# EAGLE design utilidong-ftdi-uart-mk-2.1 (EAGLE 7.5.0)
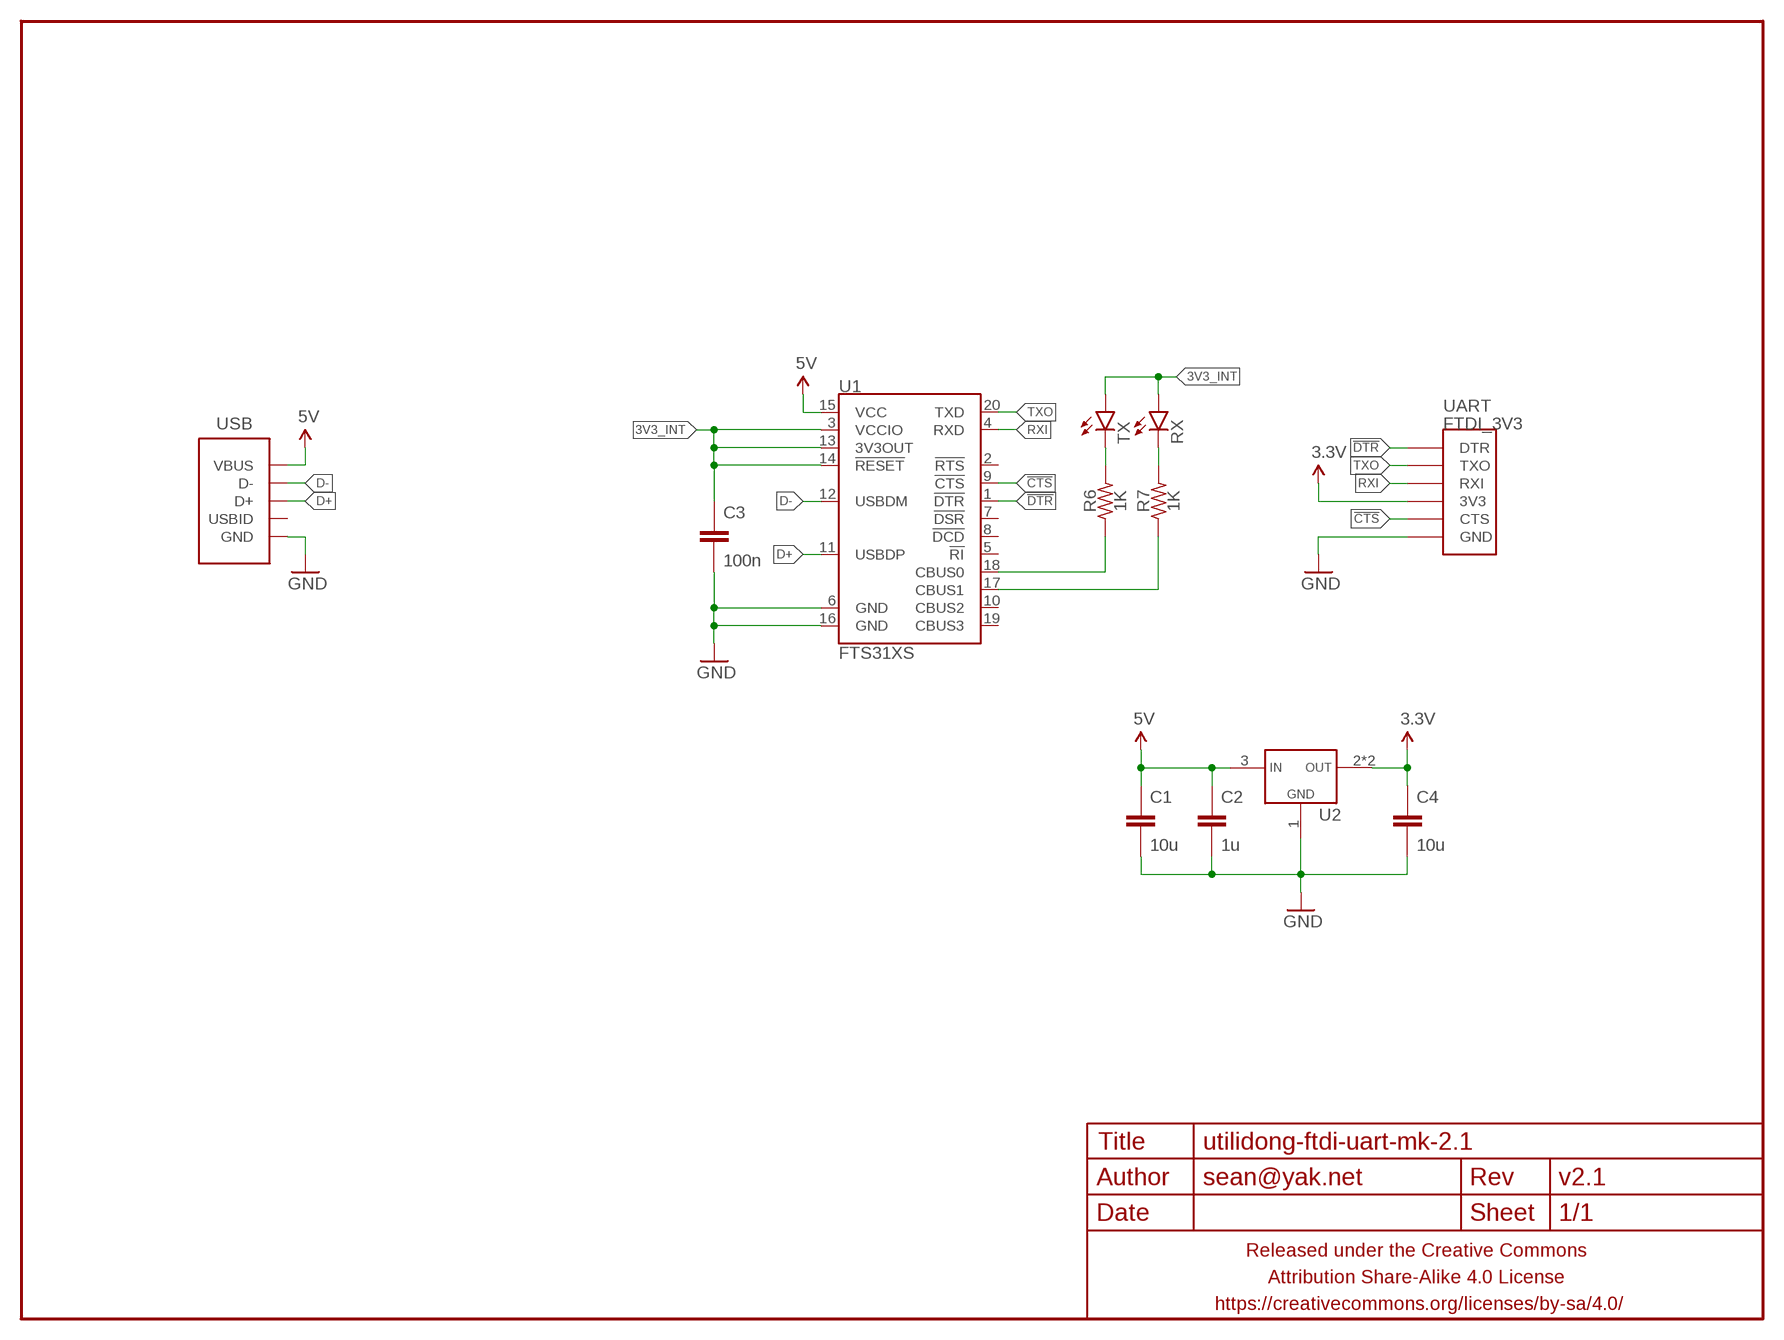
[diagram p0: schematic, sheet 1]

## Parts
C1  10u  CAPACITOR-CERAMICC0805  [C0805]
C2  1u  CAPACITOR-CERAMICC0603  [C0603]
C3  100n  CAPACITOR-CERAMICC0603  [C0603]
C4  10u  CAPACITOR-CERAMICC0805  [C0805]
FRAME1  FRAME-LETTERNO_PACKAGE  [DUMMY]
R6  1K  RESISTORR0603  [R0603]
R7  1K  RESISTORR0603  [R0603]
RX  LED0603  [LED-0603]
TX  LED0603  [LED-0603]
U1  FTS31XS  FT231XS  [SSOP20_L]
U2  VREG_1117SOT89  [SOT89]
UART  FTDI_3V3  [FTDI_3V3]
USB  USB-ABFCI-10103594-USB-MICRO-B-LESS  [FCI-10103594-USB-MICRO-B-LESS]

## Nets
3.3V: C4.1 U2.2(VOUT) U2.4(VOUT) UART.P$4(3V3)
3V3_INT: C3.1 RX.A TX.A U1.3(VCCIO) U1.13(3V3OUT) U1.14(!RESET)
5V: C1.1 C2.1 U1.15(VCC) U2.3(VIN) USB.1(VBUS)
!CTS: U1.9(!CTS) UART.P$5(CTS)
!DTR: U1.1(!DTR) UART.P$1(DTR)
D+: U1.11(USBDP) USB.3(D+)
D-: U1.12(USBDM) USB.2(D-)
GND: C1.2 C2.2 C3.2 C4.2 U1.6(GND) U1.16(GND) U2.1(GND) UART.P$6(GND) USB.5(GND)
N$7: R6.1 U1.18(CBUS0)
N$9: R6.2 TX.C
N$10: R7.2 RX.C
N$12: R7.1 U1.17(CBUS1)
RXI: U1.4(RXD) UART.P$3(RXI)
TXO: U1.20(TXD) UART.P$2(TXO)
Unconnected: U1.2(!RTS) U1.5(!RI) U1.7(!DSR) U1.8(!DCD) U1.10(CBUS2) U1.19(CBUS3) USB.4(USBID)

## Library data of the parts
C1-C4 = a_parts:CAPACITOR-CERAMIC: CAPACITOR, European symbol
FRAME1 = A_butts:FRAME-LETTER: Schematic Frame Standard 8.5x11 US Letter frame; DESIGNER: sean@yak.net; VERSION: v2.1
R6 R7 = a_parts:RESISTOR: RESISTOR, American symbol
RX TX = a_parts:LED: LEDs Standard schematic elements and footprints for 5mm, 3mm, 1206, and 0603 sized LEDs. 5mm - Spark Fun Electronics SKU : COM-00529 (and others)
U1 = a_parts:FT231X: FTDI FT231X Full Speed USB to Full-handshake UART This USB2.0 Full Speed IC offers a compact bridge to full handshake UART interfaces. The device is a UART, capable of operating up to 3MBaud, with low power consumption (8mA). The FT231X includes the complete FT-X series feature set and enables USB to be added into a system design quickly and easily over a UART interface.; PROD_ID: IC-11524; VALUE: FTS31XS-U
U2 = a_parts:VREG_1117
UART = a_parts:FTDI_3V3: Connector which mates to FTDI basic or FTDI cable.
USB = a_parts:USB-AB: This is a USB AB connector that is compatible with USB OTG. i.e. this connector can serve as a host or device

## Board
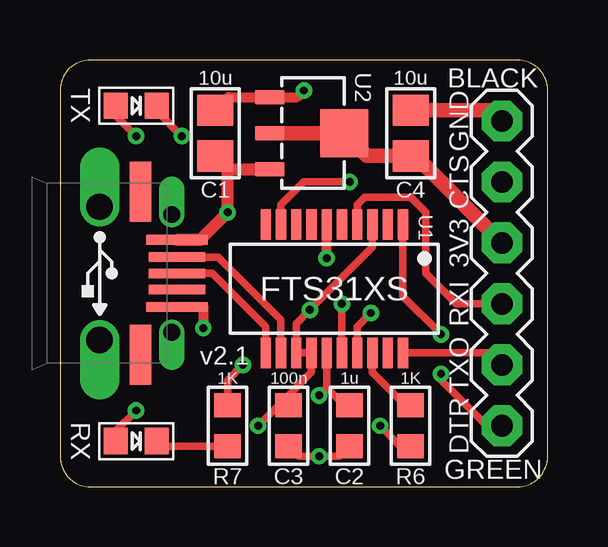
[diagram p1: board, top side]
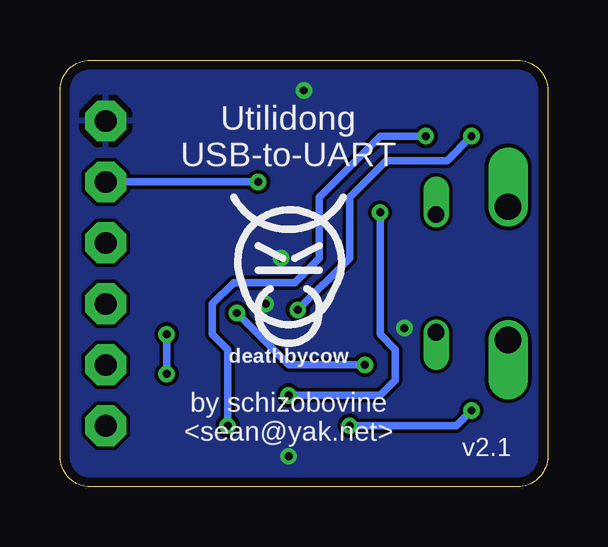
[diagram p2: board, bottom side, seen from below]

Size 20.32 x 17.78 mm. Coordinates in mm from the lower left corner, seen from the top.
Outline: 0,16.51 0,1.27 arc90 1.27,0 19.05,0 arc90 20.32,1.27 20.32,16.51 arc90 19.05,17.78 1.27,17.78 arc90 0,16.51
Copper layers (1*16): Top 0.0356mm / dielectric 1.5011mm / Bottom 0.0356mm
Design rules "LaenPCBOrder_2": minimum track width 6mil, minimum drill 13mil, track to track 6mil, track to pad 6mil, pad to pad 6mil, via to via 6mil, smd to smd 6mil, copper to edge 15mil, drill to drill 6mil, minimum pad ring 7mil, minimum via ring 7mil, stop-mask expansion 3mil, vias tented up to drill 20mil, thermal gap 10mil

### Footprints (pad centres in the part's own frame; a part is rotated, then mirrored left to right if it is on the bottom)
C0805 = smd 1.3 x 1.5: 1 -0.95,0; 2 0.95,0
C0603 = smd 1 x 1.1: 1 -0.85,0; 2 0.85,0
R0603 = smd 1 x 1.1: 1 -0.85,0; 2 0.85,0
LED-0603 = smd 1.1 x 1: A 0,-0.85; C 0,0.85
SSOP20_L = smd 0.43 x 1.27: 1 -2.857,-2.68; 2 -2.223,-2.68; 3 -1.587,-2.68; 4 -0.953,-2.68; 5 -0.318,-2.68; 6 0.318,-2.68; 7 0.953,-2.68; 8 1.587,-2.68; 9 2.223,-2.68; 10 2.857,-2.68; 11 2.857,2.68; 12 2.223,2.68; 13 1.587,2.68; 14 0.953,2.68; 15 0.318,2.68; 16 -0.318,2.68; 17 -0.953,2.68; 18 -1.587,2.68; 19 -2.223,2.68; 20 -2.857,2.68
SOT89 = smd 0.58 x 1.2: 1 -1.5,-1.8; 2 0,-1.8; 3 1.5,-1.8 | smd 2 x 2: 4 0,1.3
FTDI_3V3 = drill 0.9 pad 1.7 octagon: P$1 -6.35,0; P$2 -3.81,0; P$3 -1.27,0; P$4 1.27,0; P$5 3.81,0; P$6 6.35,0
FCI-10103594-USB-MICRO-B-LESS = smd 0.4 x 2.55: 1 -1.4,3.225; 5 1.4,3.225 | smd 0.4 x 2.35: 2 -0.675,3.225; 3 0,3.225; 4 0.675,3.225 | drill 0.7 offset: SHIELD@1 -2.45,3; SHIELD@2 2.45,3 | drill 1.1 pad 1.3 offset: SHIELD@3 -2.775,0; SHIELD@4 2.775,0 | smd 2.5 x 0.9: SHIELD@5 -3.4,1.7; SHIELD@6 3.4,1.7

### Placement (x,y rotation side)
C1  6.48,14.73 90 top
C2  12.06,2.54 270 top
C3  9.53,2.54 270 top
C4  14.61,14.73 90 top
FRAME1  0,0 0 top
R6  14.61,2.54 270 top
R7  6.99,2.54 270 top
RX  3.17,1.91 270 top
TX  3.17,15.88 270 top
U1  11.43,8.26 180 top
U2  10.54,14.73 270 top
U$3  [COW_SMALL]  10.79,9.53 0 bottom
UART  18.41,8.89 90 top
USB  1.65,8.89 270 top

### Tracks (layer width: path | path; a pad name or v marks a point on that pad's centre or on a via)
3.3V
  Top 0.61: UART.P$4 14.79,13.78 C4.1 12.79,13.78 U2.4 U2.2
3V3_INT  (via drill 0.33)
  Top 0.305: U1.3 13.02,9.97 v10.41,7.37 9.84,6.79 U1.13 U1.14 10.48,4.76 9.53,3.81 C3.1 9.11,3.39 v8.26,2.54 | RX.A 2.33,2.33 v3.17,3.17 | v3.17,14.61 2.33,15.46 TX.A
  Bottom 0.305: v8.26,2.54 3.81,2.54 v3.17,3.17 | v10.41,7.37 8.26,9.53 8.26,12.06 6.73,13.59 4.19,13.59 v3.17,14.61
5V  (via drill 0.33)
  Top 0.305: U1.15 11.11,4.13 | v10.79,3.81 11.11,4.13 | C2.1 11.85,3.39 11.11,4.13
  Top 0.406: C1.1 6.48,13.72
  Top 0.508: 6.99,13.23 U2.3 | 6.99,13.23 v6.99,11.43 5.84,10.29 USB.1 | 6.48,13.72 6.99,13.23
  Bottom 0.305: v10.79,3.81 6.99,3.81 6.35,4.45 6.35,5.71 6.99,6.35 v6.99,11.43
!CTS  (via drill 0.33)
  Top 0.305: U1.9 9.21,11.75 10.16,12.7 v12.06,12.7
  Bottom 0.305: v12.06,12.7 UART.P$5
!DTR  (via drill 0.33)
  Top 0.305: U1.1 14.29,7.94 v15.88,6.35 | v15.88,4.7 15.88,4.45 17.78,2.54 UART.P$1
  Bottom 0.305: v15.88,6.35 v15.88,4.7
D+
  Top 0.305: USB.3 6.35,8.89 8.57,6.67 U1.11
D-
  Top 0.305: USB.2 6.6,9.56 9.21,6.96 U1.12
GND  (via drill 0.33)
  Top 0.305: U1.16 v11.75,7.62 | C2.2 11.64,1.27 v10.79,1.27 9.95,1.27 C3.2
  Top 0.406: USB.5 5.97,7.49 v5.97,6.6 | v11.11,9.53 U1.6 | C1.2 7.03,16.23 U2.1 9.88,16.23 v10.16,16.51
  Top 0.61: C4.2 17.97,15.68 UART.P$6
  pour Bottom: 1.27,17.78 19.05,17.78 arc-90 20.32,16.51 20.32,1.27 arc-90 19.05,0 1.27,0 arc-90 0,1.27 0,16.51 arc-90
N$7
  Top 0.305: U1.18 13.02,4.76 14.39,3.39 R6.1
N$9  (via drill 0.33)
  Top 0.305: R6.2 14.19,1.69 v13.34,2.54 | v5.08,14.61 4.03,15.66 TX.C
  Bottom 0.305: v13.34,2.54 13.34,5.71 13.97,6.35 13.97,7.62 13.08,8.51 10.54,8.51 9.53,9.53 9.53,12.06 6.99,14.61 v5.08,14.61
N$10
  Top 0.305: RX.C 4.24,1.69 R7.2
N$12  (via drill 0.33)
  Top 0.305: v7.62,5.08 6.99,4.45 R7.1 | U1.17 12.38,6.67 v12.95,7.24
  Bottom 0.305: v12.95,7.24 10.79,5.08 v7.62,5.08
RXI
  Top 0.305: U1.4 12.38,11.75 12.7,12.06 14.61,12.06 15.24,11.43 15.24,8.89 16.51,7.62 UART.P$3
TXO
  Top 0.305: U1.20 17.92,5.58 UART.P$2

### Text on the board
bPlace: Utilidong / USB-to-UART | by schizobovine / <sean@yak.net>